# EAGLE design ShuntTest_2 (EAGLE 8.3.1)
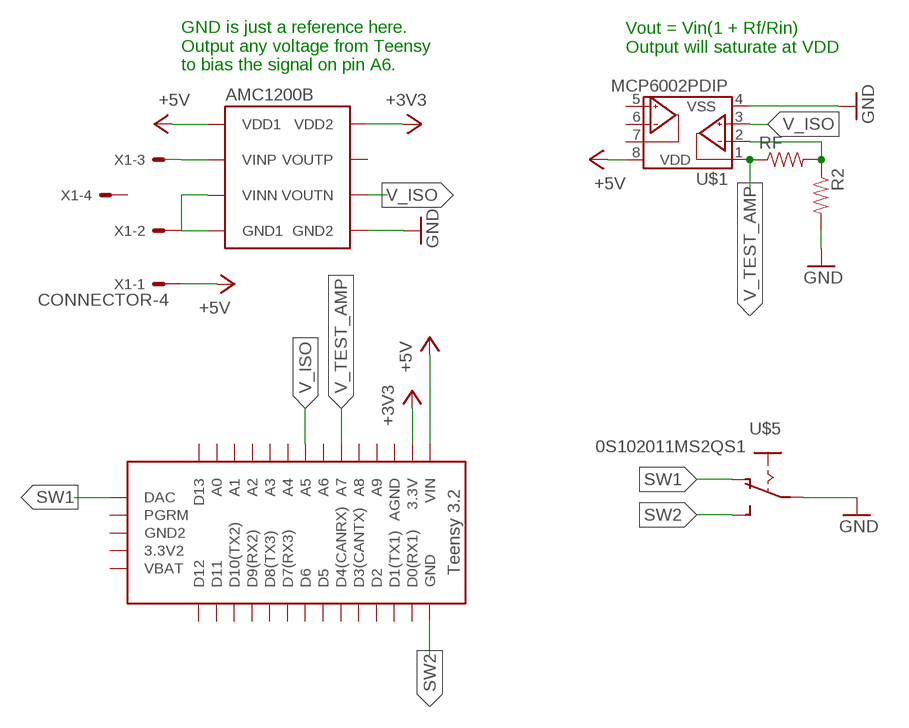
[diagram p0: schematic, sheet 1]

## Parts
R2  RESISTOR0402  [0402-RES]
RF  RESISTOR0402  [0402-RES]
U$1  MCP6002PDIP  [DIL08]
U$2  TEENSY_3.2_EXT  [TEENSY_3.2_EXT]
U$3  AMC1200B  [AMC1200B]
U$5  0S102011MS2QS1  [0S102011MS2QS1]
X1  CONNECTOR-4  [MINIFIT_5566-4]

## Nets
+3V3: U$2.3.3V U$3.VDD2
+5V: U$1.8(VDD) U$2.VIN U$3.VDD1 X1.1
GND: R2.2 U$1.4(VSS) U$3.GND2 U$5.P$2(P)
N$1: U$3.GND1 U$3.VINN X1.2
N$2: U$3.VINP X1.3
N$4: R2.1 RF.2 U$1.2(VINA-)
SW1: U$2.DAC U$5.P$1(O)
SW2: U$2.GND U$5.P$3(S)
V_ISO: U$1.3(VINA+) U$2.A5 U$3.VOUTN
V_TEST_AMP: RF.1 U$1.1(VOUTA) U$2.A7
Unconnected: U$1.5(VINB+) U$1.6(VINB-) U$1.7(VOUTB) U$2.3.3V2 U$2.A0 U$2.A1 U$2.A2 U$2.A3 U$2.A4 U$2.A6 U$2.A8 U$2.A9 U$2.AGND U$2.D0(RX1) U$2.D1(TX1) U$2.D2 U$2.D3(CANTX) U$2.D4(CANRX) U$2.D5 U$2.D6 U$2.D7(RX3) U$2.D8(TX3) U$2.D9(RX2) U$2.D10(TX2) U$2.D11 U$2.D12 U$2.D13 U$2.GND2 U$2.PGRM U$2.VBAT U$3.VOUTP X1.4

## Notes on the sheet
- Vout = Vin(1 + Rf/Rin)
  Output will saturate at VDD
- GND is just a reference here.
  Output any voltage from Teensy
  to bias the signal on pin A6.

## Library data of the parts
R2 RF = HyTechDevices:RESISTOR: Resistor Basic schematic elements and footprints for 0603, 1206, and PTH resistors.
U$1 = HyTechDevices:MCP6002: Microchip MCP6002 Dual Channel Op Amp
U$2 = HyTechDevices:TEENSY_3.2_EXT: Version of the Teensy LC board that uses the 2 main rows of pins and the pins opposite the usb port.
U$3 = HyTechDevices:AMC1200B
U$5 = HyTechDevices:0S102011MS2QS1: Slide Switch 0S102011MS2QS1
X1 = HyTechDevices:CONNECTOR-4: Mini-Fit Junior connector 4 pole Source: http://www.molex.com; OC_FARNELL: unknown; OC_NEWARK: unknown

## Board
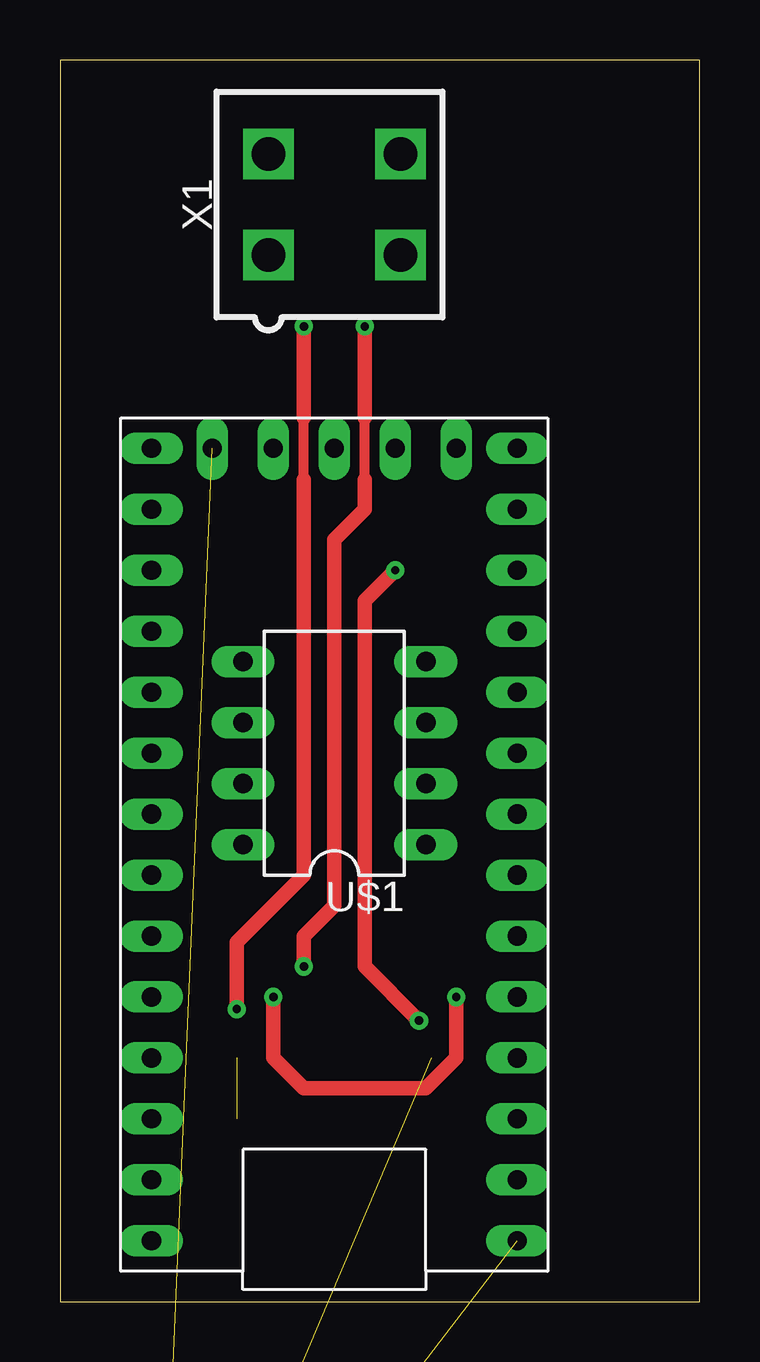
[diagram p1: board, top side]
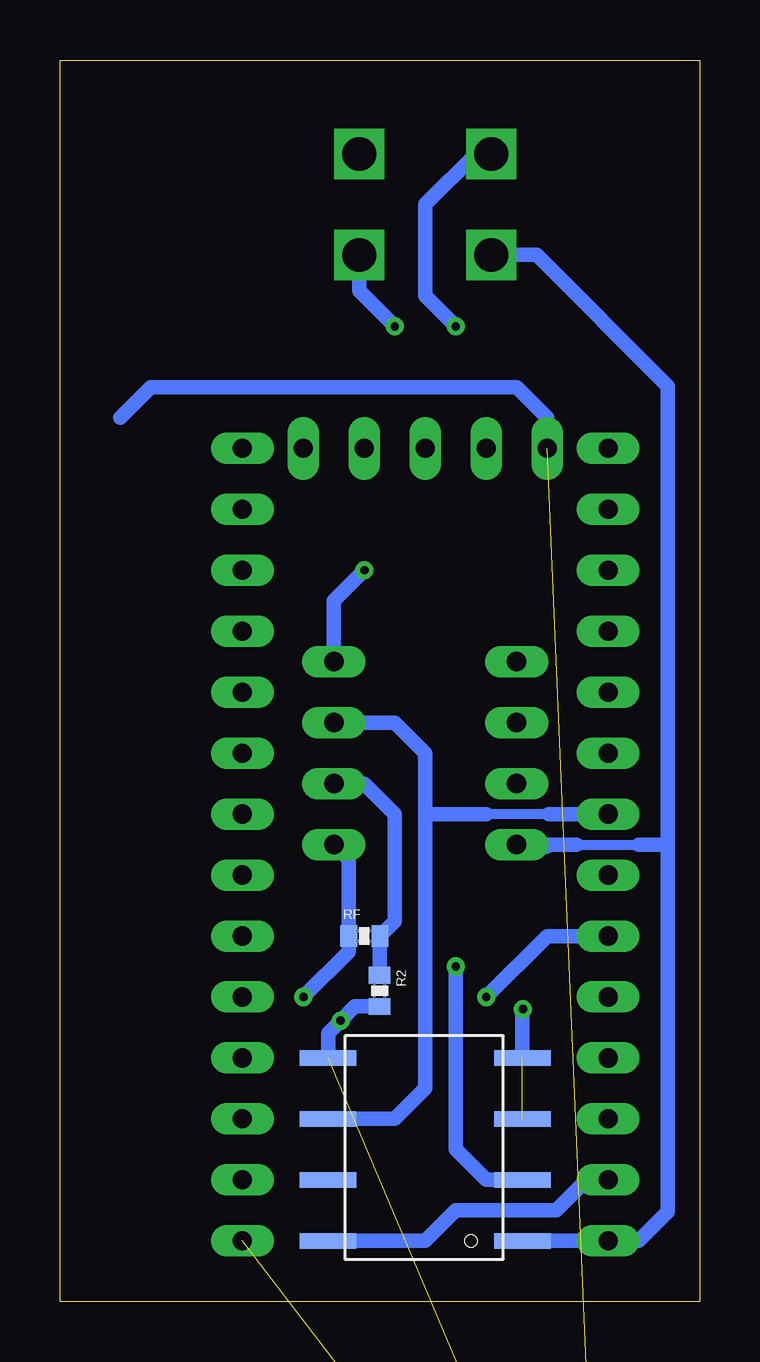
[diagram p2: board, bottom side, seen from below]

Size 26.65 x 51.74 mm. Coordinates in mm from the lower left corner, seen from the top.
Outline: 0,0 26.65,0 26.65,51.74 0,51.74 0,0
Copper layers (1*16): Top 0.035mm / dielectric 1.5mm / Bottom 0.035mm
Design rules "default *": minimum track width 6mil, minimum drill 0.35mm, track to track 16mil, track to pad 16mil, pad to pad 16mil, via to via 16mil, smd to smd 16mil, copper to edge 40mil, drill to drill 6mil, minimum pad ring 10mil, minimum via ring 8mil, stop-mask expansion 4mil, vias tented up to drill 0mil, thermal gap 10mil

### Footprints (pad centres in the part's own frame; a part is rotated, then mirrored left to right if it is on the bottom)
0402-RES = smd 0.7 x 0.9: 1 -0.65,0; 2 0.65,0
DIL08 = drill 0.813 long: 1 -3.81,-3.81; 2 -1.27,-3.81; 3 1.27,-3.81; 4 3.81,-3.81; 5 3.81,3.81; 6 1.27,3.81; 7 -1.27,3.81; 8 -3.81,3.81
TEENSY_3.2_EXT = drill 0.8 long: 3.3V 16.51,31.75; 3.3V2 6.35,1.27; A0 16.51,3.81; A1 16.51,6.35; A2 16.51,8.89; A3 16.51,11.43; A4 16.51,13.97; A5 16.51,16.51; A6 16.51,19.05; A7 16.51,21.59; A8 16.51,24.13; A9 16.51,26.67; AGND 16.51,29.21; D0(RX1) 1.27,31.75; D1(TX1) 1.27,29.21; D2 1.27,26.67; D3(CANTX) 1.27,24.13; D4(CANRX) 1.27,21.59; D5 1.27,19.05; D6 1.27,16.51; D7(RX3) 1.27,13.97; D8(TX3) 1.27,11.43; D9(RX2) 1.27,8.89; D10(TX2) 1.27,6.35; D11 1.27,3.81; D12 1.27,1.27; D13 16.51,1.27; DAC 13.97,1.27; GND 1.27,34.29; GND2 8.89,1.27; PGRM 11.43,1.27; VBAT 3.81,1.27; VIN 16.51,34.29
AMC1200B = smd 2.35 x 0.65: GND1 -4.05,0; GND2 4.05,0; VDD1 -4.05,7.62; VDD2 4.05,7.62; VINN -4.05,2.54; VINP -4.05,5.08; VOUTN 4.05,2.54; VOUTP 4.05,5.08
0S102011MS2QS1 = drill 0.8 long: P$1 -2,0; P$2 0,0; P$3 2,0 | hole 1.27: 4.102,0; -4.102,0
MINIFIT_5566-4 = drill 1.4 square: 1 2.1,-2.75; 2 -2.1,-2.75; 3 2.1,2.75; 4 -2.1,2.75

### Placement (x,y rotation side)
R2  13.34,12.95 270 bottom
RF  13.97,15.24 0 bottom
U$1  11.43,22.86 90 top
U$2  20.32,36.83 180 top
U$3  11.43,10.16 180 bottom
U$5  6.35,-11.43 0 top  (outside the outline)
X1  11.43,45.72 270 top

### Tracks (layer width: path | path; a pad name or v marks a point on that pad's centre or on a via)
+3V3
  Bottom 0.61: U$3.VDD2 11.43,2.54 10.16,3.81 5.97,3.81 4.7,5.08 U$2.3.3V
+5V
  Bottom 0.406: 5.12,19.05 2.54,19.05
  Bottom 0.61: U$3.VDD1 U$2.VIN 2.54,2.54 1.32,3.76 1.32,19.24 | 1.32,19.24 1.32,38.15 6.79,43.62 X1.1 | U$1.8 6.45,18.95 6.39,18.95 6.29,19.05 5.12,19.05 | 2.54,19.05 1.51,19.05 arc-90 1.32,19.24
GND  (via drill 0.35)  (1 unrouted)
  Top 0.61: v13.97,30.48 12.7,29.21 12.7,13.97 v14.96,11.71
  Bottom 0.61: v13.97,30.48 15.24,29.21 U$1.4 | U$3.GND2 15.48,11.19 v14.96,11.71 14.37,12.3 R2.2
N$1  (via drill 0.35)  (1 unrouted)
  Top 0.406: 10.16,34.24 10.16,36.83
  Top 0.61: v7.37,12.19 7.37,14.99 10.16,17.78 10.16,34.24 | 10.16,36.83 v10.16,40.64
  Bottom 0.61: 7.62,10.16 U$3.GND1 7.38,12.18 v7.37,12.19 | X1.2 9.33,47.82 11.43,45.72 11.43,41.91 v10.16,40.64
N$2  (via drill 0.35)
  Top 0.406: 12.7,34.24 12.7,36.83
  Top 0.61: 12.7,36.83 v12.7,40.64 | v10.16,13.97 10.16,15.24 11.43,16.51 11.43,31.75 12.7,33.02 12.7,34.24
  Bottom 0.61: U$3.VINP 8.89,5.08 10.16,6.35 v10.16,13.97 | X1.3 14.18,42.12 v12.7,40.64
N$4
  Bottom 0.61: R2.1 13.32,13.62 RF.2 12.7,15.86 12.7,20.32 13.97,21.59 U$1.2
SW1  (1 unrouted)
  Bottom 0.61: U$2.DAC 6.35,36.83 7.62,38.1 22.86,38.1 24.13,36.83
SW2  (1 unrouted)
V_ISO
  Bottom 0.406: 6.29,20.32 8.89,20.32
  Bottom 0.61: U$3.VOUTN 12.7,7.62 11.43,8.89 11.43,20.34 | U$1.3 12.7,24.13 11.43,22.86 11.43,20.34 | U$2.A5 6.29,20.32 | 8.89,20.32 11.41,20.32 11.43,20.34
V_TEST_AMP  (via drill 0.35)
  Top 0.61: v16.51,12.7 16.51,10.16 15.24,8.89 10.16,8.89 8.89,10.16 v8.89,12.7
  Bottom 0.61: U$1.1 14.62,18.43 RF.1 14.62,14.59 v16.51,12.7 | U$2.A7 6.35,15.24 v8.89,12.7